# Altium schematic sheet DAC_Schematic.SchDoc
size A
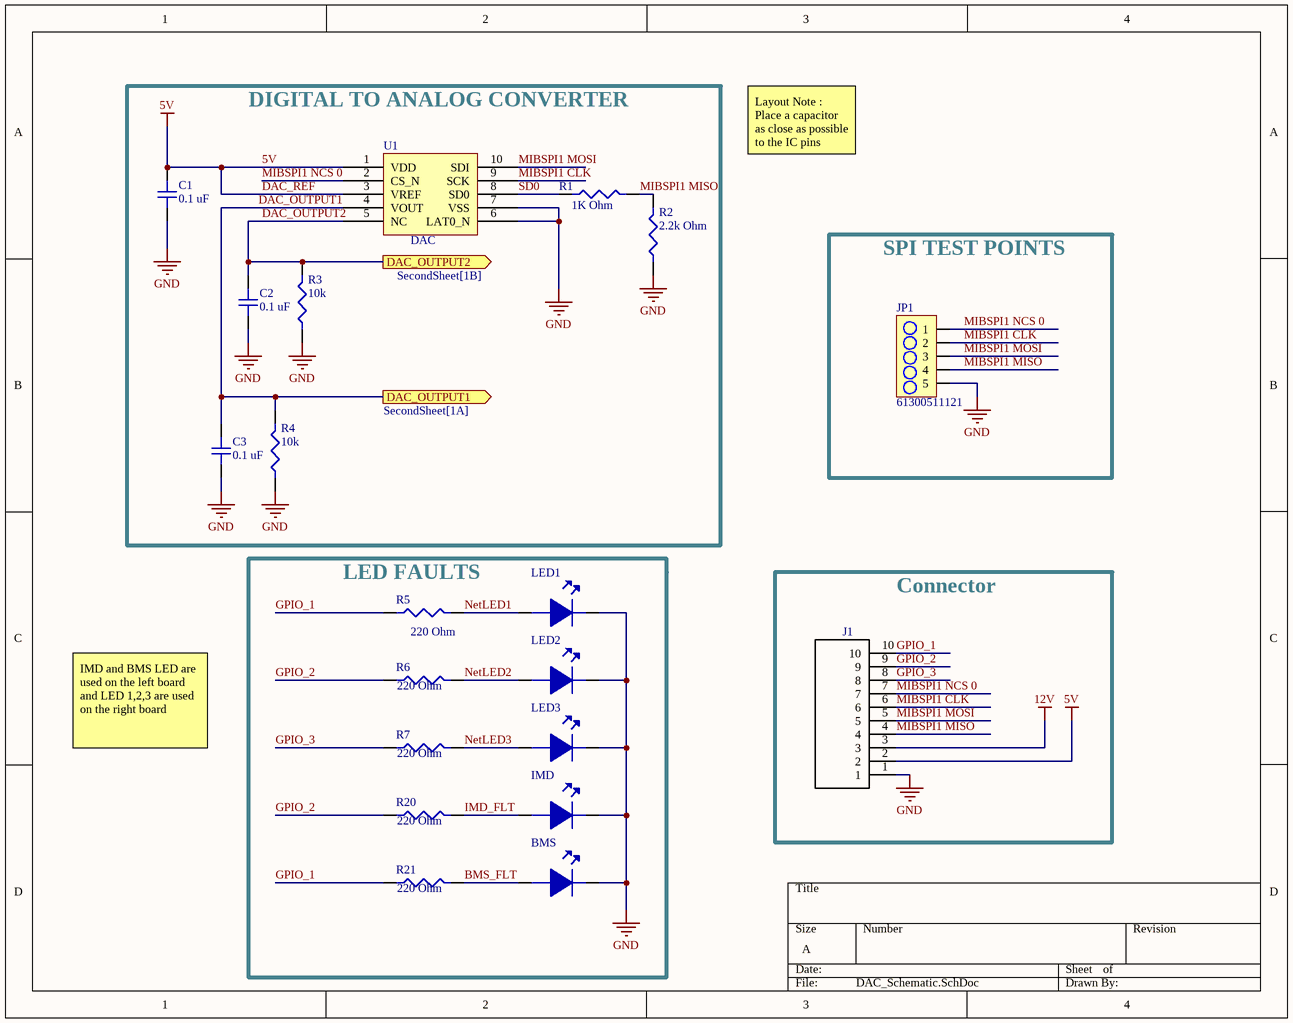
[diagram p0: DAC_Schematic.SchDoc]

## Parts
BMS  C503B-RAN-CZ0C0AA1  [Diode]  (value not drawn)
C1  0.1 uF  [CAPC1608X09N]
C2  0.1 uF  [CAPC1608X09N]
C3  0.1 uF  [CAPC1608X09N]
IMD  C503B-RAN-CZ0C0AA1  [Diode]  (value not drawn)
J1  103635-9  [*TE_103635-9]  (value not drawn)
JP1  61300511121  [5PIN_HEADER]
LED1  C503B-RAN-CZ0C0AA1  [Diode]  (value not drawn)
LED2  C503B-RAN-CZ0C0AA1  [Diode]  (value not drawn)
LED3  C503B-RAN-CZ0C0AA1  [Diode]  (value not drawn)
R1  1K Ohm  [RESC2012X06N]
R2  2.2k Ohm  [RESC2012X06N]
R3  10k  [RESC2012X06N]
R4  10k  [RESC2012X06N]
R5  220 Ohm  [RESC2012X06N]
R6  220 Ohm  [RESC2012X06N]
R7  220 Ohm  [RESC2012X06N]
R20  220 Ohm  [RESC2012X06N]
R21  220 Ohm  [RESC2012X06N]
U1  DAC  [TSSOP50P490X110-10N]

## Blocks framed on the sheet
DIGITAL TO ANALOG CONVERTER: C1-C3 R1-R4 U1
SPI TEST POINTS: JP1
LED FAULTS: BMS IMD LED1-LED3 R5-R7 R20 R21
Connector: J1

## Ports
DAC_OUTPUT1 (out, see SecondSheet[1A]), DAC_OUTPUT2 (out, see SecondSheet[1B])

## Nets
5V: C1.2 J1.2 U1.1(VDD) U1.3(VREF)  [also labelled DAC_REF]
12V: J1.3
GND: BMS.A C1.1 C2.1 C3.1 IMD.A J1.1 JP1.5 LED1.A LED2.A LED3.A R2.1 R3.1 R4.1 U1.6(LAT0_N) U1.7(VSS)
BMS_FLT: BMS.K R21.2
DAC_OUTPUT1: C3.2 R4.2 U1.4(VOUT) ; port DAC_OUTPUT1
DAC_OUTPUT2: C2.2 R3.2 U1.5(NC) ; port DAC_OUTPUT2
GPIO_1: J1.10 R5.1 R21.1
GPIO_2: J1.9 R6.1 R20.1
GPIO_3: J1.8 R7.1
IMD_FLT: IMD.K R20.2
MIBSPI1 CLK: J1.6 JP1.2 U1.9(SCK)
MIBSPI1 MISO: J1.4 JP1.4 R1.2 R2.2
MIBSPI1 MOSI: J1.5 JP1.3 U1.10(SDI)
MIBSPI1 NCS 0: J1.7 JP1.1 U1.2(CS_N)
NetLED1: LED1.K R5.2
NetLED2: LED2.K R6.2
NetLED3: LED3.K R7.2
SD0: R1.1 U1.8(SD0)

## Notes on the sheet
- Layout Note : Place a capacitor as close as possible to the IC pins
- IMD and BMS LED are used on the left board and LED 1,2,3 are used on the right board

## Library data of the parts
BMS IMD LED1-LED3 = C503B-RAN-CZ0C0AA1: LED Uni-Color Red 2-Pin T-1 3/4 Cardboard; Manufacturer: Cree; Lens Color: Colorless; Lens Style: Round,Domed; Lens Transparency: Clear; Luminous Intensity: 20550mcd; Forward Voltage: 2.1V; Test Current: 20mA; Viewing Angle: 15°; Dominant Wavelength: 624nm; Lens Size: 5mm; Supplier 1: Digi-Key; Manufacturer Part Number: C503B-RAN-CZ0C0AA1; Stock 1: 146433; Pricing 1: 1=0.15, 10=0.141, 100=0.1303, 1000=0.11653, 50000=0.10821 (USD); Mount: Through Hole; Case/Package: Radial; Color: Red; Packaging: Bulk; Height: 10.1mm; ComponentLink1URL: https://www.cree.com/led-components/media/documents/C503B-RAS-RAN-AAS-AAN-RBS-RBN-ABS-ABN-RCS-RCN-ACS-ACN-1079.pdf?src-supplier=Digi-Key; ComponentLink1Description: https://www.cree.com/led-components/media/documents/C503B-RAS-RAN-AAS-AAN-RBS-RBN-ABS-ABN-RCS-RCN-ACS-ACN-1079.pdf?src-supplier=Digi-Key; Supplier Part Number 1: C503B-RAN-CZ0C0AA1-ND
C1-C3 = C0603C104Z3VACTU: KEMET - C0603C104Z3VACTU - Multilayer Ceramic Capacitor, C Series, 0.1 - F, +80%, -20%, Y5V, 25 V, 0603 [1608 Metric] RoHS Compliant: Yes; Capacitance: 100nF; Tolerance: 80%; Voltage Rating: 25V; Dissipation Factor: 7%; Supplier 1: Digi-Key; Manufacturer: KEMET; Manufacturer Part Number: C0603C104Z3VACTU; Stock 1: 1377515; Pricing 1: 1=0.1, 10=0.032, 100=0.0143, 500=0.0102, 1000=0.00802 (USD); Mount: Surface Mount,PCB; Case/Package: 0603; Number of Pins: 2; Case Code (Metric): 1608; Case Code (Imperial): 0603; Dielectric Material: Ceramic; Min Operating Temperature: -30°C; Max Operating Temperature: 85°C; Packaging: Tape and Reel; Voltage Rating (DC): 25V; Package Quantity: 1; Dielectric: Y5V; Termination: SMD/SMT; Voltage: 25V; Length: 1.6mm; Height: 0.8mm; Width: 0.031inch; Thickness: 0.034inch; Lead Pitch: 0.7mm; Depth: 0.8mm; Radiation Hardening: No; REACH SVHC: No SVHC; Lead Free: Lead Free; ComponentLink1URL: http://www.farnell.com/datasheets/1470417.pdf?src-supplier=Element14; ComponentLink1Description: http://www.farnell.com/datasheets/1470417.pdf?src-supplier=Element14; ComponentLink2URL: http://www.farnell.com/datasheets/1828802.pdf?src-supplier=Element14; ComponentLink2Description: http://www.farnell.com/datasheets/1828802.pdf?src-supplier=Element14; ComponentLink3URL: http://www.alliedelec.com/m/d/9bfe7773041ffe9d406e68bc7b377fdd.pdf?src-supplier=Allied+Electronics; ComponentLink3Description: http://www.alliedelec.com/m/d/9bfe7773041ffe9d406e68bc7b377fdd.pdf?src-supplier=Allied+Electronics; Supplier Part Number 1: 399-1100-1-ND
J1 = 103635-9: 10 MTE HDR SRRA LATCH .100CL; Number_of_Positions: 10; Product_Type: Connector; Centerline_Pitch: 2.54 mm[.1 in]; MF: TE Connectivity; TE_purchase_URL: https://www.te.com/usa-en/product-103635-9.html?te_bu=Cor&te_type=disp&te_campaign=seda_glo_cor-seda-global-disp-prtnr-fy19-seda-model-bom-cta_sma-317_1&elqCampaignId=32493; Digi-Key_Purchase_URL: https://www.digikey.ca/product-detail/en/te-connectivity-amp-connectors/103635-9/A28643-ND/298697?utm_source=snapeda&utm_medium=aggregator&utm_campaign=symbol; MP: 103635-9; Package: None; SnapEDA_Link: https://www.snapeda.com/parts/103635-9/TE%20Connectivity/view-part/?ref=snap; Digi-Key_Part_Number: A28643-ND; EU_RoHS_Compliance: Not Compliant; Value: *
JP1 = 61300511121: WURTH ELEKTRONIK         61300511121            Board-To-Board Connector, Vertical, WR-PHD Series, Through Hole, Header, 5 Contacts, 2.54 mm; Manufacturer: Wurth Electronics; Number of Positions: 5; Gender: Male; Connector Type: Male Pin; Pitch: 0.1inch; Supplier 1: Digi-Key; Manufacturer Part Number: 61300511121; Stock 1: 28976; Pricing 1: 1=0.25, 10=0.209, 25=0.174, 50=0.145, 100=0.132, 1000=0.12 (USD); Mount: Through Hole; Contact Plating: Gold; Contact Material: Copper; Color: Black; Number of Rows: 1; Packaging: Bulk; Termination: Solder; Number of Contacts: 5; Contact Mating Length: 0.236inch; REACH SVHC: Unknown; Lead Free: Lead Free; ComponentLink1URL: https://katalog.we-online.de/em/datasheet/6130xx11121.pdf?src-supplier=Digi-Key; ComponentLink1Description: https://katalog.we-online.de/em/datasheet/6130xx11121.pdf?src-supplier=Digi-Key; ComponentLink2URL: http://www.farnell.com/cad/1737268.pdf?src-supplier=Element14; ComponentLink2Description: http://www.farnell.com/cad/1737268.pdf?src-supplier=Element14; Supplier Part Number 1: 732-5318-ND
R1 = RC0805JR-071KL: RES SMD 1K OHM 5% 1/8W 0805; Manufacturer: Yageo; Resistance: 1kR; Power Rating: 125mW; Voltage Rating: 150V; Temperature Coefficient: 100ppm/°C; Supplier 1: Digi-Key; Manufacturer Part Number: RC0805JR-071KL; Stock 1: 6376783; Pricing 1: 1=0.1, 10=0.032, 100=0.0132, 1000=0.00594, 2500=0.00515 (USD); Case/Package: 0805; Case Code (Imperial): 0805; Case Code (Metric): 2012; Contact Plating: Tin,Lead,Matte; Min Operating Temperature: -55°C; Max Operating Temperature: 155°C; Tolerance: 5%; Packaging: Tape and Reel; Termination: SMD/SMT; Composition: Thick Film; Military Standard: Not; Length: 2mm; Depth: 1.25mm; Radiation Hardening: No; REACH SVHC: Unknown; Lead Free: Lead Free; ComponentLink1URL: http://www.farnell.com/datasheets/2167052.pdf?src-supplier=Verical; ComponentLink1Description: http://www.farnell.com/datasheets/2167052.pdf?src-supplier=Verical; ComponentLink2URL: http://www.farnell.com/datasheets/2167052.pdf?src-supplier=Mouser; ComponentLink2Description: http://www.farnell.com/datasheets/2167052.pdf?src-supplier=Mouser; ComponentLink3URL: http://www.farnell.com/datasheets/2167052.pdf?src-supplier=Element14; ComponentLink3Description: http://www.farnell.com/datasheets/2167052.pdf?src-supplier=Element14; ComponentLink4URL: http://www.farnell.com/datasheets/444164.pdf?src-supplier=Element14; ComponentLink4Description: http://www.farnell.com/datasheets/444164.pdf?src-supplier=Element14; Supplier Part Number 1: 311-1.0KARDKR-ND
R2 = RC0805FR-072K2L: RES SMD 2.2K OHM 1% 1/8W 0805; Manufacturer: Yageo; Power Rating: 125mW; Resistance: 2.2kR; Temperature Coefficient: 100ppm/°C; Voltage Rating: 150V; Supplier 1: Digi-Key; Manufacturer Part Number: RC0805FR-072K2L; Stock 1: 4627797; Pricing 1: 1=0.1, 10=0.04, 100=0.0163, 1000=0.00731, 2500=0.00635 (USD); Case/Package: 0805; Number of Pins: 2; Case Code (Imperial): 0805; Case Code (Metric): 2012; Min Operating Temperature: -55°C; Max Operating Temperature: 155°C; Tolerance: 1%; Packaging: Tape and Reel; Voltage Rating (DC): 150V; Package Quantity: 1; Termination: SMD/SMT; Composition: Thick Film; Number of Terminations: 2; Max Power Dissipation: 125mW; Features: Moisture Resistant; Military Standard: Not; Length: 2mm; Height: 0.5mm; Width: 1.25mm; Depth: 1.25mm; Lead Pitch: 0.4mm; REACH SVHC: Unknown; Lead Free: Lead Free; ComponentLink1URL: http://www.farnell.com/datasheets/38627.pdf?src-supplier=Element14; ComponentLink1Description: http://www.farnell.com/datasheets/38627.pdf?src-supplier=Element14; ComponentLink2URL: http://www.farnell.com/datasheets/444164.pdf?src-supplier=Element14; ComponentLink2Description: http://www.farnell.com/datasheets/444164.pdf?src-supplier=Element14; ComponentLink3URL: http://www.yageo.com/documents/recent/PYu-RC_Group_51_RoHS_L_9.pdf?src-supplier=Digi-Key; ComponentLink3Description: http://www.yageo.com/documents/recent/PYu-RC_Group_51_RoHS_L_9.pdf?src-supplier=Digi-Key; ComponentLink4URL: http://www.yageo.com/documents/recent/PYu-RC_Group_51_RoHS_L_10.pdf?src-supplier=Digi-Key; ComponentLink4Description: http://www.yageo.com/documents/recent/PYu-RC_Group_51_RoHS_L_10.pdf?src-supplier=Digi-Key; Supplier Part Number 1: 311-2.20KCRCT-ND
R3 R4 = RNCP0805FTD10K0: RES 10K OHM 1% 1/4W 0805; Manufacturer: Stackpole Electronics; Resistance: 10kR; Max Power Dissipation: 250mW; Temperature Coefficient: 100ppm/°C; Supplier 1: Digi-Key; Manufacturer Part Number: RNCP0805FTD10K0; Stock 1: 277525; Pricing 1: 1=0.1, 10=0.072, 100=0.0277, 1000=0.0122, 2500=0.01053 (USD); Mount: Surface Mount; Case/Package: 0805; Case Code (Metric): 2012; Case Code (Imperial): 0805; Min Operating Temperature: -55°C; Max Operating Temperature: 155°C; Tolerance: 1%; Packaging: Tape and Reel; Composition: Thin Film; Number of Terminations: 2; Features: Moisture Resistant,Anti-Sulfur; Length: 0.079inch; Height: 0.024inch; Width: 0.049inch; Lead Free: Lead Free; ComponentLink1URL: https://www.seielect.com/catalog/SEI-Packaging.pdf?src-supplier=Digi-Key; ComponentLink1Description: https://www.seielect.com/catalog/SEI-Packaging.pdf?src-supplier=Digi-Key; Supplier Part Number 1: RNCP0805FTD10K0CT-ND
R5-R7 R20 R21 = CRGCQ0805F220R: TE CONNECTIVITY - CRGCQ0805F220R - RES, 220R, 1%, 0805, THICK FILM; Supplier 1: Digi-Key; Manufacturer: TE Connectivity; Manufacturer Part Number: CRGCQ0805F220R; Stock 1: 73679; Pricing 1: 1=0.1, 10=0.048, 100=0.0196, 1000=0.00882, 2500=0.00766 (USD); ComponentLink1URL: https://4donline.ihs.com/images/VipMasterIC/IC/TYEL/TYEL-S-A0004929575/TYEL-S-A0004929575-1.pdf?hkey=52A5661711E402568146F3353EA87419&src-supplier=Farnell; ComponentLink1Description: https://4donline.ihs.com/images/VipMasterIC/IC/TYEL/TYEL-S-A0004929575/TYEL-S-A0004929575-1.pdf?hkey=52A5661711E402568146F3353EA87419&src-supplier=Farnell; ComponentLink2URL: https://www.te.com/commerce/DocumentDelivery/DDEController?Action=srchrtrv&amp;DocNm=1773204-3&amp;DocType=DS&amp;DocLang=English&src-supplier=Digi-Key; ComponentLink2Description: https://www.te.com/commerce/DocumentDelivery/DDEController?Action=srchrtrv&amp;DocNm=1773204-3&amp;DocType=DS&amp;DocLang=English&src-supplier=Digi-Key; Supplier Part Number 1: A129741CT-ND
U1 = MCP48FVB02-E/UN: MICROCHIP - MCP48FVB02-E/UN - DAC, 8BIT, DUAL, MSOP-10; Number of Bits: 8; Number of D/A Converters: 2; Settling Time: 7.8us; Differential Output: No; Interface: SPI; Resolution: 8b; Supplier 1: Digi-Key; Manufacturer: Microchip; Manufacturer Part Number: MCP48FVB02-E/UN; Stock 1: 135; Pricing 1: 1=1.16, 25=0.97, 100=0.88 (USD); Case/Package: MSOP; Number of Pins: 10; Min Operating Temperature: -40°C; Max Operating Temperature: 125°C; Packaging: Rail/Tube; REACH SVHC: No SVHC; ComponentLink1URL: http://www.farnell.com/datasheets/2002391.pdf?src-supplier=Element14; ComponentLink1Description: http://www.farnell.com/datasheets/2002391.pdf?src-supplier=Element14; ComponentLink2URL: http://www.farnell.com/datasheets/2002391.pdf?src-supplier=Farnell; ComponentLink2Description: http://www.farnell.com/datasheets/2002391.pdf?src-supplier=Farnell; ComponentLink3URL: http://www.microchip.com/mymicrochip/filehandler.aspx?ddocname=en576860&src-supplier=Digi-Key; ComponentLink3Description: http://www.microchip.com/mymicrochip/filehandler.aspx?ddocname=en576860&src-supplier=Digi-Key; Supplier Part Number 1: MCP48FVB02-E/UN-ND